# Altium schematic sheet CoverPage.SchDoc
size 420 x 297 mm; Revision: 1.1.0; SheetNumber: 1; SheetTotal: 15
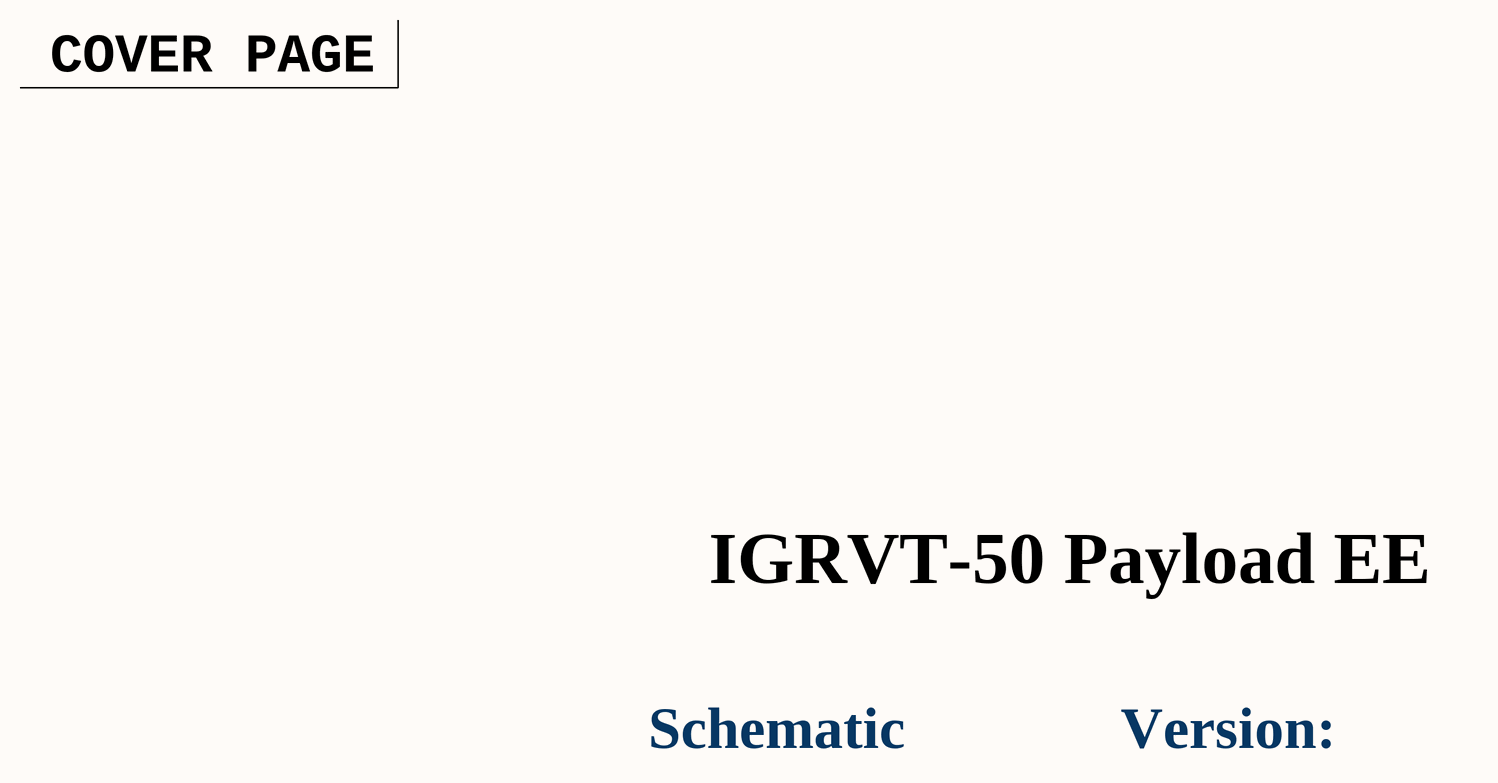
[diagram p0: CoverPage.SchDoc]

## Notes on the sheet
- COVER PAGE
- IGRVT-50 Payload EE
- Schematic
- Version:
- Project:
- DAL_PDU
- Sub-system:
- IGRVT-50
- Design by:
- KIEN HOANG
- BAO BUI
- Sheet title:
- Sheet
- A3
- of
- Checked by:
- Approved by:
- VU PHAM
- Revision:
- Document No:
- Size:
- Date: